# Altium schematic sheet ST-Link-V2.2-Mini.SchDoc
size A
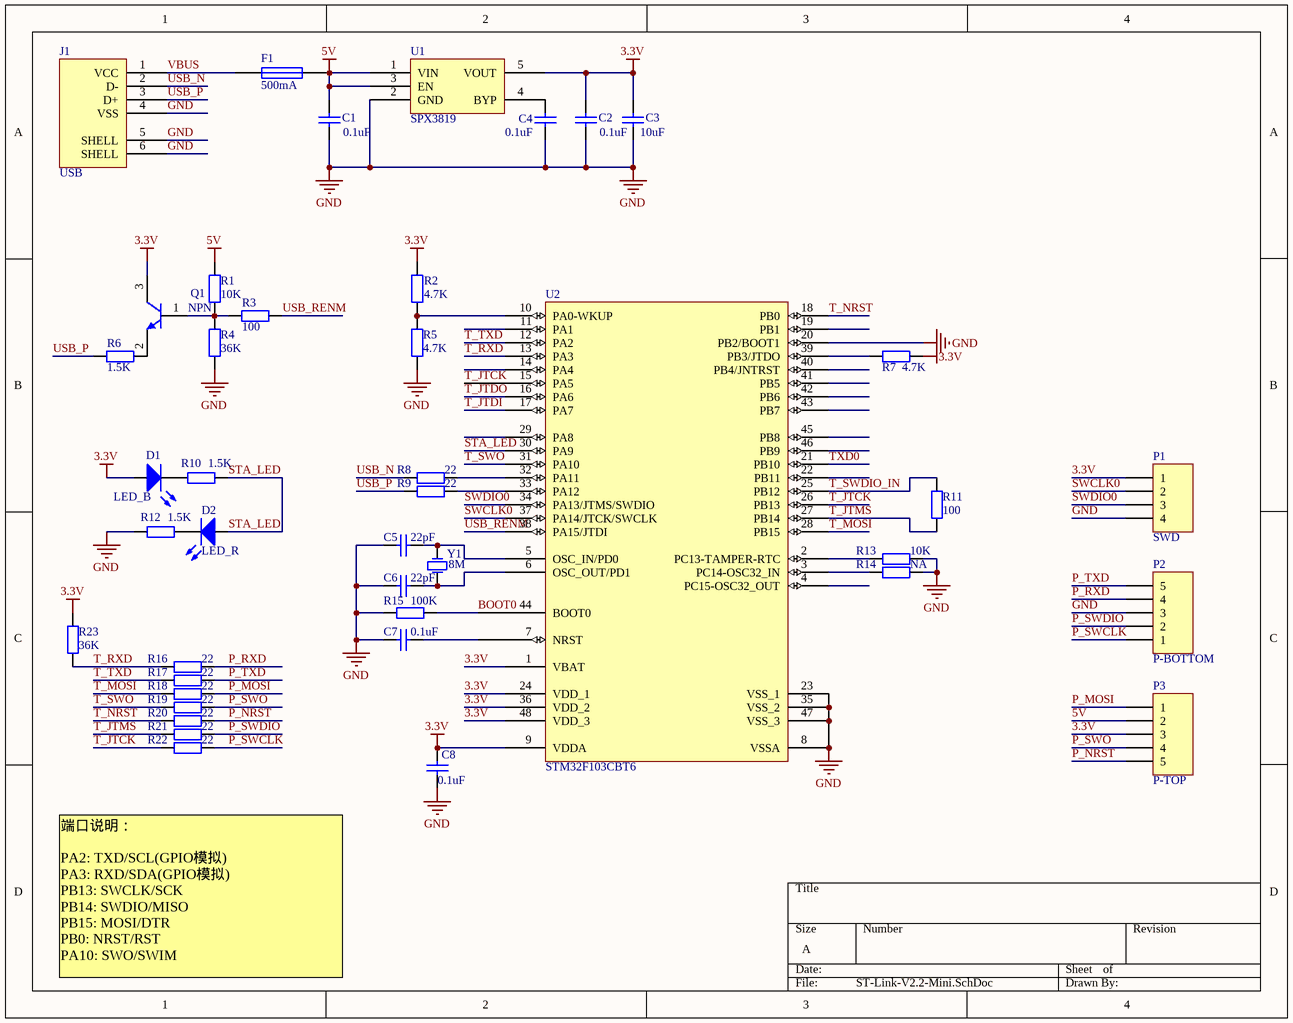
[diagram p0: ST-Link-V2.2-Mini.SchDoc]

## Parts
C1  value 0.1uF  [C-0603]  (hidden comment: Cap)
C2  value 0.1uF  [C-0603]  (hidden comment: Cap)
C3  value 10uF  [C-0603]  (hidden comment: Cap)
C4  value 0.1uF  [C-0603]  (hidden comment: Cap)
C5  value 22pF  [C-0603]  (hidden comment: Cap)
C6  value 22pF  [C-0603]  (hidden comment: Cap)
C7  value 0.1uF  [C-0603]  (hidden comment: Cap)
C8  value 0.1uF  [C-0603]  (hidden comment: Cap)
D1  LED_B  [SMT_LED_0603]
D2  LED_R  [SMT_LED_0603]
F1  value 500mA  [0805-1]  (hidden comment: Fuse1)
J1  USB  [USB-B]
P1  SWD  [SIP4-1.27]
P2  P-BOTTOM  [HEADER_5]
P3  P-TOP  [HEADER_5]
Q1  NPN  [SOT23-3]
R1  value 10K  [0603-1]  (hidden comment: Res1)
R2  value 4.7K  [0603-1]  (hidden comment: Res2)
R3  value 100  [0603-1]  (hidden comment: Res1)
R4  value 36K  [0603-1]  (hidden comment: Res1)
R5  value 4.7K  [0603-1]  (hidden comment: Res2)
R6  value 1.5K  [0603-1]  (hidden comment: Res1)
R7  value 4.7K  [0603-1]  (hidden comment: Res2)
R8  value 22  [0603-1]  (hidden comment: Res2)
R9  value 22  [0603-1]  (hidden comment: Res2)
R10  value 1.5K  [0603-1]  (hidden comment: Res2)
R11  value 100  [0603-1]  (hidden comment: Res2)
R12  value 1.5K  [0603-1]  (hidden comment: Res2)
R13  value 10K  [0603-1]  (hidden comment: Res1)
R14  value NA  [0603-1]  (hidden comment: Res1)
R15  value 100K  [0603-1]  (hidden comment: Res2)
R16  value 22  [0603-1]  (hidden comment: Res2)
R17  value 22  [0603-1]  (hidden comment: Res2)
R18  value 22  [0603-1]  (hidden comment: Res2)
R19  value 22  [0603-1]  (hidden comment: Res2)
R20  value 22  [0603-1]  (hidden comment: Res2)
R21  value 22  [0603-1]  (hidden comment: Res2)
R22  value 22  [0603-1]  (hidden comment: Res2)
R23  value 36K  [0603-1]  (hidden comment: Res1)
U1  SPX3819  [SOT23-5]
U2  STM32F103CBT6  [LQFP48_N]
Y1  8M  [XAL5032 2-Leads]

## Nets
3.3V: C2.2 C3.2 C8.2 D1.1(A) P1.1 P3.3 Q1.3(C) R2.2 R7.2 R23.1 U1.5(VOUT) U2.1(VBAT) U2.9(VDDA) U2.24(VDD_1) U2.36(VDD_2) U2.48(VDD_3)
5V: C1.2 F1.2 P3.2 R1.1 U1.1(VIN) U1.3(EN)
GND: C1.1 C2.1 C3.1 C4.1 C5.1 C6.1 C7.1 C8.1 J1.4(VSS) J1.5(SHELL) J1.6(SHELL) P1.4 P2.3 R4.2 R5.1 R12.1 R13.2 R14.2 R15.1 U1.2(GND) U2.8(VSSA) U2.20(PB2/BOOT1) U2.23(VSS_1) U2.35(VSS_2) U2.47(VSS_3)
BOOT0: R15.2 U2.44(BOOT0)
P_MOSI: P3.1 R18.2
P_NRST: P3.5 R20.2
P_RXD: P2.4 R16.2
P_SWCLK: P2.1 R22.2
P_SWDIO: P2.2 R21.2
P_SWO: P3.4 R19.2
P_TXD: P2.5 R17.2
STA_LED: D2.1(A) R10.2 U2.30(PA9)
SWCLK0: P1.2 U2.37(PA14/JTCK/SWCLK)
SWDIO0: P1.3 U2.34(PA13/JTMS/SWDIO)
T_JTCK: R22.1 U2.15(PA5) U2.26(PB13)
T_JTDI: U2.17(PA7)
T_JTDO: U2.16(PA6)
T_JTMS: R11.1 R21.1 U2.27(PB14)
T_MOSI: R18.1 U2.28(PB15)
T_NRST: R20.1 U2.18(PB0)
T_RXD: R16.1 R23.2 U2.13(PA3)
T_SWDIO_IN: R11.2 U2.25(PB12)
T_SWO: R19.1 U2.31(PA10)
T_TXD: R17.1 U2.12(PA2)
TXD0: U2.21(PB10)
USB_N: J1.2(D-) R8.1
USB_P: J1.3(D+) R6.2 R9.1
USB_RENM: R3.2 U2.38(PA15/JTDI)
VBUS: F1.1 J1.1(VCC)
NetC4_2: C4.2 U1.4(BYP)
NetC5_2: C5.2 U2.5(OSC_IN/PD0) Y1.1(OSC1)
NetC6_2: C6.2 U2.6(OSC_OUT/PD1) Y1.2(OSC2)
NetC7_2: C7.2 U2.7(NRST)
NetD1_2: D1.2(K) R10.1
NetD2_2: D2.2(K) R12.2
NetQ1_1: Q1.1(B) R1.2 R3.1 R4.1
NetQ1_2: Q1.2(E) R6.1
NetR2_1: R2.1 R5.2 U2.10(PA0-WKUP)
NetR7_1: R7.1 U2.39(PB3/JTDO)
NetR8_2: R8.2 U2.32(PA11)
NetR9_2: R9.2 U2.33(PA12)
NetR13_1: R13.1 U2.2(PC13-TAMPER-RTC)
NetR14_1: R14.1 U2.3(PC14-OSC32_IN)

Not connected (* = marked no-connect by the designer): U2 4(PC15-OSC32_OUT) 11(PA1) 14(PA4) 19(PB1) 22(PB11) 29(PA8) 40(PB4/JNTRST) 41(PB5) 42(PB6) 43(PB7) 45(PB8) 46(PB9)

## Notes on the sheet
- 端口说明：
  PA2: TXD/SCL(GPIO模拟)
  PA3: RXD/SDA(GPIO模拟)
  PB13: SWCLK/SCK
  PB14: SWDIO/MISO
  PB15: MOSI/DTR
  PB0: NRST/RST
  PA10: SWO/SWIM

## Library data of the parts
C1-C4 C8 = Cap: Capacitor; Published: 8-Jun-2000; LatestRevisionDate: 17-Jul-2002; LatestRevisionNote: Re-released for DXP Platform.; PackageReference: RAD-0.3; Publisher: Altium Limited; PackageDescription: Radial Cap, Thru-Hole; 2 Leads; 0.3 in Pin Spacing
D1 D2 = LED2: Typical RED, GREEN, YELLOW, AMBER GaAs LED; Published: 8-Jun-2000; LatestRevisionDate: 17-Jul-2002; LatestRevisionNote: Re-released for DXP Platform.; PackageVersion: Feb-2002; PackageReference: 3.2X1.6X1.1; Publisher: Altium Limited; PackageDescription: SM LED; 2 Flat Leads
F1 = Fuse1: 保险丝
J1 = USB: USB接口
P1 = Header 4: Header, 4-Pin; LatestRevisionDate: 17-Jul-2002; LatestRevisionNote: Re-released for DXP Platform.; Publisher: Altium Limited
P2 P3 = Header 5: Header, 5-Pin; LatestRevisionDate: 17-Jul-2002; LatestRevisionNote: Re-released for DXP Platform.; Publisher: Altium Limited
Q1 = NPN1: 贴片三极管; Published: 8-Jun-2000; LatestRevisionDate: 15-Jan-2003; LatestRevisionNote: PCB Footprint 'BCY-W3/D4.7' replaced; DatasheetDocument: 1997; PackageDocument: Sep-1998; PackageReference: TO-92A; Publisher: Altium Limited; Code_JEDEC: TO-92A; ComponentLink1Description: Manufacturer Link; ComponentLink1URL: http://www.fairchildsemi.com/; ComponentLink2Description: Datasheet; ComponentLink2URL: http://www.fairchildsemi.com/ds/2N%2F2N3904.pdf
R1 R3 R4 R6 R13 R14 R23 = Res1: 贴片电阻; Published: 8-Jun-2000; LatestRevisionDate: 17-Jul-2002; LatestRevisionNote: Re-released for DXP Platform.; PackageReference: AXIAL-0.4; Publisher: Altium Limited
R2 R5 R7-R12 R15-R22 = Res2: Resistor; Published: 8-Jun-2000; LatestRevisionDate: 17-Jul-2002; LatestRevisionNote: Re-released for DXP Platform.; PackageReference: AXIAL-0.4; Publisher: Altium Limited; PackageDescription: Axial Device, Thru-Hole; 2 Leads; 0.4 in Pin Spacing
U2 = STM32F103C8T6: STM32 ARM-based 32-bit MCU with 64 Kbytes Flash, 48-pin LQFP, Industrial Temperature; Published: 30-May-2008; DatasheetVersion: rev6, Mar-2008; PackageVersion: Mar-2008; PackageReference: LQFP48; Publisher: Altium Limited; PackageDescription: 48-Pin Low-Profile Quad Flat Pack, 7 x 7 mm Body, 0.5 mm Pitch (LQFP48); ComponentLink1Description: Manufacturer Link; ComponentLink1URL: www.st.com/stm32; ComponentLink2Description: Datasheet; ComponentLink2URL: http://www.st.com/stonline/products/literature/ds/13587.pdf
Y1 = XTAL: Crystal Oscillator; Manufacturer: Generic Components; Published: 08/06/2000; Publisher: Altium Hobart Technology Centre; Class: Oscillator; SubClass: Crystal Oscillator